# EAGLE schematic Frisk_Schematic (EAGLE 9.7.0)
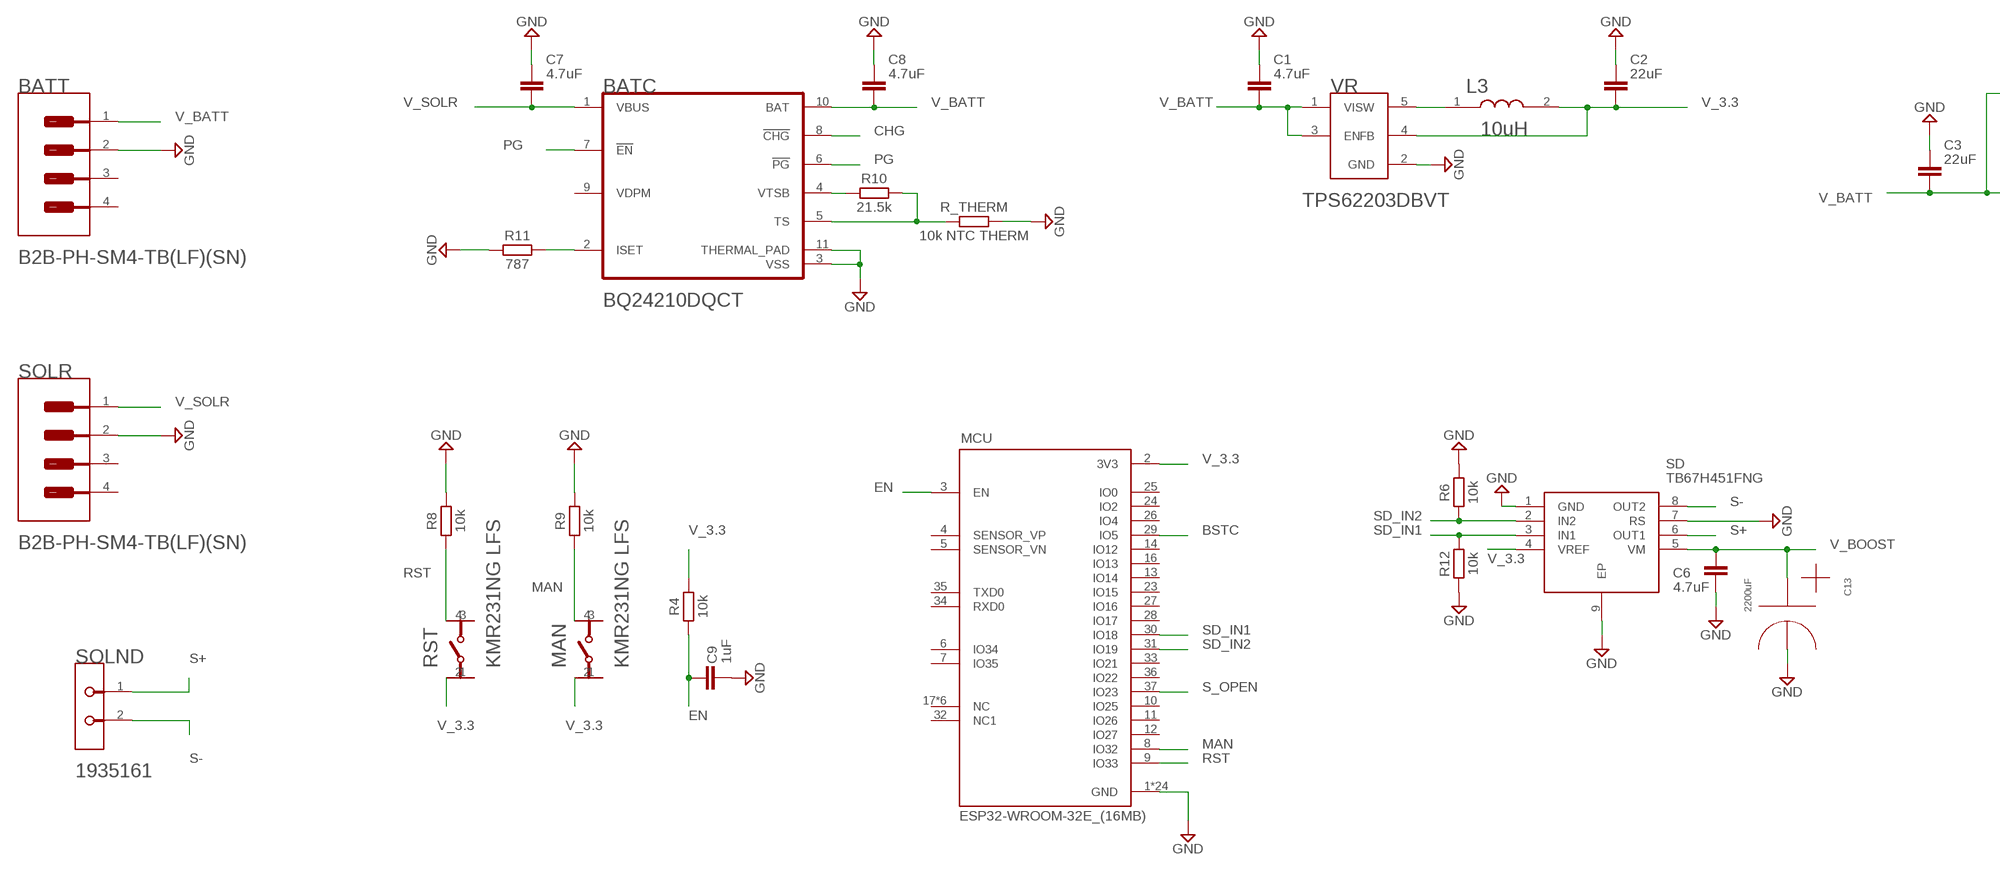
[diagram p0: schematic, sheet 1, part 1 of 2]
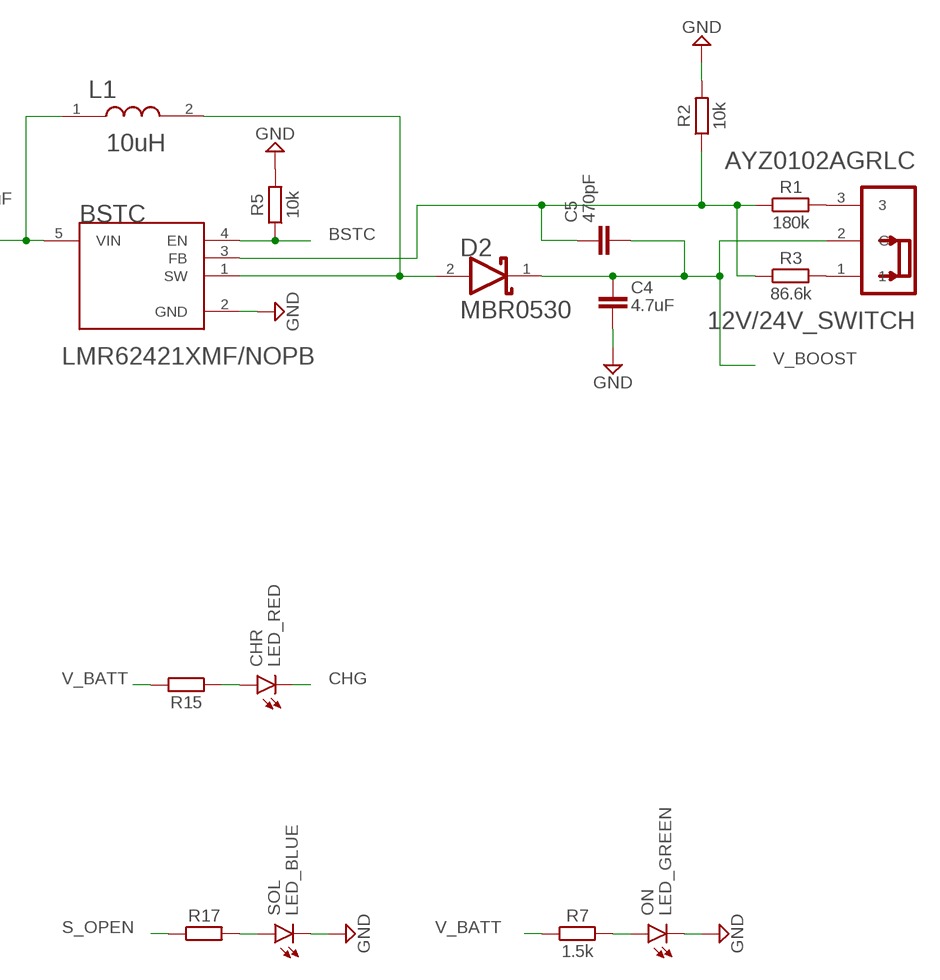
[diagram p1: schematic, sheet 1, part 2 of 2]

## Parts
12V/24V_SWITCH  C&K_AYZ0102AGRLCC&K_AYZ0102AGRLC_0_0  [C&K_AYZ0102AGRLC_0]
BATC  TEXAS_INSTRUMENTS_BQ24210DQCTTEXAS_INSTRUMENTS_BQ24210DQCT_0_2  [TEXAS_INSTRUMENTS_BQ24210DQCT_2]
BATT  JST_B2B-PH-SM4-TB_LF_SNJST_B2B-PH-SM4-TB_LF_SN_0_0  [JST_B2B-PH-SM4-TB_LF_SN_0]
BSTC  TEXAS_INSTRUMENTS_LMR62421XMF-NOPBTEXAS_INSTRUMENTS_LMR62421XMF-NOPB_0_0  [TEXAS_INSTRUMENTS_LMR62421XMF-NOPB_0]
C1  4.7uF  C_CHIP-0603(1608-METRIC)  [CAPC1608X85]
C2  22uF  C_CHIP-1210(3225-METRIC)  [CAPC3225X135]
C3  22uF  C_CHIP-1210(3225-METRIC)  [CAPC3225X135]
C4  4.7uF  C_CHIP-0603(1608-METRIC)  [CAPC1608X85]
C5  470pF  C_CHIP-0603(1608-METRIC)  [CAPC1608X85]
C6  4.7uF  C_CHIP-0603(1608-METRIC)  [CAPC1608X85]
C7  4.7uF  C_CHIP-0603(1608-METRIC)  [CAPC1608X85]
C8  4.7uF  C_CHIP-0603(1608-METRIC)  [CAPC1608X85]
C9  1uF  C_CHIP-0603(1608-METRIC)  [CAPC1608X85]
C13  UVZ1E222  [CAPPRD500W60D1250H2700]
CHR  LED_RED  CHIP-ROUND-R_0603  [LEDC1608X65N_RND-R]
D2  ON_SEMI_MBR0530ON_SEMI_MBR0530_0_2  [ON_SEMI_MBR0530_2]
L1  VISHAY_IHLP2525CZER100M01VISHAY_IHLP2525CZER100M01_0_0  [VISHAY_IHLP2525CZER100M01_0]
L3  VISHAY_IHLP2525CZER100M01VISHAY_IHLP2525CZER100M01_0_0  [VISHAY_IHLP2525CZER100M01_0]
MAN  C&K_COMPONENTS_KMR231NG_LFSC&K_COMPONENTS_KMR231NG_LFS_0_0  [C&K_COMPONENTS_KMR231NG_LFS_0]
MCU  ESP32-WROOM-32E_(16MB)  [MODULE_ESP32-WROOM-32E_(16MB)]
ON  LED_GREEN  CHIP-ROUND-R_0603  [LEDC1608X65N_RND-R]
R1  180k  R_CHIP-0603(1608-METRIC)  [RESC1608X60]
R2  10k  R_CHIP-0603(1608-METRIC)  [RESC1608X60]
R3  86.6k  R_CHIP-0603(1608-METRIC)  [RESC1608X60]
R4  10k  R_CHIP-0603(1608-METRIC)  [RESC1608X60]
R5  10k  R_CHIP-0603(1608-METRIC)  [RESC1608X60]
R6  10k  R_CHIP-0603(1608-METRIC)  [RESC1608X60]
R7  1.5k  R_CHIP-0603(1608-METRIC)  [RESC1608X60]
R8  10k  R_CHIP-0603(1608-METRIC)  [RESC1608X60]
R9  10k  R_CHIP-0603(1608-METRIC)  [RESC1608X60]
R10  21.5k  R_CHIP-0603(1608-METRIC)  [RESC1608X60]
R11  787  R_CHIP-0603(1608-METRIC)  [RESC1608X60]
R12  10k  R_CHIP-0603(1608-METRIC)  [RESC1608X60]
R15  1.5k  R_CHIP-0603(1608-METRIC)  [RESC1608X60]
R17  1.5k  R_CHIP-0603(1608-METRIC)  [RESC1608X60]
R_THERM  10k NTC THERM  R_CHIP-0603(1608-METRIC)  [RESC1608X60]
RST  C&K_COMPONENTS_KMR231NG_LFSC&K_COMPONENTS_KMR231NG_LFS_0_0  [C&K_COMPONENTS_KMR231NG_LFS_0]
SD  TB67H451FNG  [SOIC127P600X170-9N]
SOL  LED_BLUE  CHIP-ROUND-R_0603  [LEDC1608X65N_RND-R]
SOLND  PHOENIX_CONTACT_1935161PHOENIX_CONTACT_1935161_0_0  [PHOENIX_CONTACT_1935161_0]
SOLR  JST_B2B-PH-SM4-TB_LF_SNJST_B2B-PH-SM4-TB_LF_SN_0_0  [JST_B2B-PH-SM4-TB_LF_SN_0]
VR  TEXAS_INSTRUMENTS_TPS62203DBVTTEXAS_INSTRUMENTS_TPS62203DBVT_0_0  [TEXAS_INSTRUMENTS_TPS62203DBVT_0]

## Nets
BSTC: BSTC.4(EN) MCU.29(IO5) R5.1
CHG: BATC.8(!CHG!) CHR.C
EN [V_LOW]: C9.1 MCU.3(EN) R4.1
GND [GND]: BATC.3(VSS) BATC.11(THERMAL_PAD) BATT.2 BSTC.2(GND) C1.1 C2.1 C3.1 C4.2 C6.2 C7.1 C8.1 C9.2 C13.N MCU.1(GND) MCU.15(GND) MCU.38(GND) MCU.39_1(GND) MCU.39_2(GND) MCU.39_3(GND) MCU.39_4(GND) MCU.39_5(GND) MCU.39_6(GND) MCU.39_7(GND) MCU.39_8(GND) MCU.39_9(GND) MCU.39_10(GND) MCU.39_11(GND) MCU.39_12(GND) MCU.39_13(GND) MCU.39_14(GND) MCU.39_15(GND) MCU.39_16(GND) MCU.39_17(GND) MCU.39_18(GND) MCU.39_19(GND) MCU.39_20(GND) MCU.39_21(GND) ON.C R2.2 R5.2 R6.2 R8.2 R9.2 R11.1 R12.1 R_THERM.2 SD.1(GND) SD.7(RS) SD.9(EP) SOL.C SOLR.2 VR.2(GND)
MAN: MAN.4 MCU.8(IO32) R9.1
N$1: CHR.A R15.1
N$2: L3.1 VR.5(SW)
N$3: ON.A R7.2
N$4: BATC.5(TS) R10.2 R_THERM.1
N$5: BSTC.1(SW) D2.2(ANODE) L1.2
N$7: BSTC.3(FB) C5.1 R1.1 R2.1 R3.1
N$8: 12V/24V_SWITCH.3 R1.2
N$9: 12V/24V_SWITCH.1 R3.2
N$10: BATC.4(VTSB) R10.1
N$11: BATC.2(ISET) R11.2
N$18: R17.2 SOL.A
PG: BATC.6(!PG!) BATC.7(!EN!)
RST: MCU.9(IO33) R8.1 RST.4
S+ [V_HIGH]: SD.6(OUT1) SOLND.1
S- [V_HIGH]: SD.8(OUT2) SOLND.2
S_OPEN: MCU.37(IO23) R17.1
SD_IN1: MCU.30(IO18) R12.2 SD.3(IN1)
SD_IN2: MCU.31(IO19) R6.1 SD.2(IN2)
V_3.3 [V_LOW]: C2.2 L3.2 MAN.2 MCU.2(3V3) R4.2 RST.2 SD.4(VREF) VR.4(FB)
V_BATT [V_LOW]: BATC.10(BAT) BATT.1 BSTC.5(VIN) C1.2 C3.2 C8.2 L1.1 R7.1 R15.2 VR.1(VI) VR.3(EN)
V_BOOST [V_HIGH]: 12V/24V_SWITCH.2(C) C4.1 C5.2 C6.1 C13.P D2.1(CATHODE) SD.5(VM)
V_SOLR [V_LOW]: BATC.1(VBUS) C7.2 SOLR.1
Unconnected: BATT.3(MNT_1) BATT.4(MNT_2) MAN.1 MAN.3 MCU.4(SENSOR_VP) MCU.5(SENSOR_VN) MCU.6(IO34) MCU.7(IO35) MCU.10(IO25) MCU.11(IO26) MCU.12(IO27) MCU.13(IO14) MCU.14(IO12) MCU.16(IO13) MCU.17(NC) MCU.18(NC) MCU.19(NC) MCU.20(NC) MCU.21(NC) MCU.22(NC) MCU.23(IO15) MCU.24(IO2) MCU.25(IO0) MCU.26(IO4) MCU.27(IO16) MCU.28(IO17) MCU.32(NC1) MCU.33(IO21) MCU.34(RXD0) MCU.35(TXD0) MCU.36(IO22) RST.1 RST.3 SOLR.3(MNT_1) SOLR.4(MNT_2)

## Power pins joined to a net without a drawn wire
VDPM: BATC.9(VDPM)

## Library data of the parts
12V/24V_SWITCH = C&K - AYZ0102AGRLC:C&K_AYZ0102AGRLC: Miniature Slide Switches; AUTOMOTIVE: No; CENTROID_NOT_SPECIFIED: No; CONTACT_CURRENT_RATING: 100mA; CONTACT_RESISTANCE: 80mΩ; DATASHEET: https://www.ckswitches.com/media/1431/ayz.pdf; DEVICE_CLASS_L1: Electromechanical; DEVICE_CLASS_L2: Switches; DEVICE_CLASS_L3: Slide Switches; DIGIKEY_DESCRIPTION: SWITCH SLIDE SPDT 100MA 12V; DIGIKEY_PART_NUMBER: 401-2012-1-ND; ELECTROMECHANICAL_LIFE: 10000Cycles; FOOTPRINT_VARIANT_NAME_0: Recommended_Land_Pattern; HEIGHT: 1.5mm; LEAD_FREE: Yes; MF: C&K; MFG_PACKAGE_IDENT: 0; MFG_PACKAGE_IDENT_DATE: 0; MFG_PACKAGE_IDENT_REV: 0; MOUNT: Surface Mount; MOUSER_DESCRIPTION: Slide Switches SPDT SMT 1.2A SUBMIN; MOUSER_PART_NUMBER: 611-AYZ0102AGRLC; MPN: AYZ0102AGRLC; PACKAGE: SMT_7MM2_5MM3; PREFIX: SW; ROHS: Yes; TEMPERATURE_RANGE_HIGH: +60°C; TEMPERATURE_RANGE_LOW: -10°C; THROW_CONFIGURATION: SPDT; VERIFICATION_VERSION: 0.0.0.3; VOLTAGE_RATING_DC: 12V
BATC = Texas Instruments - BQ24210DQCT:TEXAS_INSTRUMENTS_BQ24210DQCT: 800mA, single-input, single cell Li-ion Solar battery charger, 10-WSON (3x2); AUTOMOTIVE: No; CENTROID_NOT_SPECIFIED: No; DATASHEET: https://www.ti.com/lit/ds/symlink/bq24210.pdf?ts=1599751812951&ref_url=https%253A%252F%252Fwww.ti.com%252Fstore%252Fti%252Fen%252Fp%252Fproduct%252F%253Fp%253DBQ24210DQCT%2526keyMatch%253DBQ24210DQCT%2526tisearch%253DSearch-EN-everything%2526usecase%253DOPN; DEVICE_CLASS_L1: Integrated Circuits (ICs); DEVICE_CLASS_L2: Power Management ICs; DEVICE_CLASS_L3: Battery Management; DIGIKEY_DESCRIPTION: IC BATT CHARGER LI-ION 10WSON; DIGIKEY_PART_NUMBER: 296-28738-1-ND; FOOTPRINT_PARAMETERS_1: {"fp_type":"DFN","params":{"N":{"nom":10,"long name":"Number of leads","min":null,"max":null,"short name":"N","type":"count"},"A":{"nom":750000,"long name":"Height","min":700000,"max":800000,"short name":"A","type":"measurement"},"A1":{"nom":25000,"long name":"Package clearance","min":0,"max":50000,"short name":"A1","type":"measurement"},"A2":{"nom":725000,"long name":"Package height","min":650000,"max":800000,"short name":"A2","type":"measurement"},"D":{"nom":3000000,"long name":"Package length","min":2900000,"max":3100000,"short name":"D","type":"measurement"},"E":{"nom":2000000,"long name":"Package width","min":1900000,"max":2100000,"short name":"E","type":"measurement"},"B":{"nom":250000,"long name":"Lead width","min":200000,"max":300000,"short name":"B","type":"measurement"},"C":{"nom":200000,"long name":"Lead thickness","min":null,"max":null,"short name":"C","type":"measurement"},"L":{"nom":300000,"long name":"Lead foot length","min":250000,"max":350000,"short name":"L","type":"measurement"},"e":{"nom":500000,"long name":"Lead pitch","min":null,"max":null,"short name":"e","type":"measurement"},"HT":{"default":"Yes","long name":"Thermal pad","type":"multichoiceparent","short name":"HT","children":["D2","E2","PC"]},"offset x":{"nom":0,"long name":"X Center offset","min":null,"max":null,"short name":"offset x","type":"measurement"},"offset y":{"nom":0,"long name":"Y Center offset","min":null,"max":null,"short name":"offset y","type":"measurement"},"LS":{"default":"Rounded rectangle","long name":"Land shape","type":"multichoice","short name":"LS"},"LS1":{"default":"Rectangle","long name":"Land shape (Pin 1)","type":"multichoice","short name":"LS1"},"solder toe":{"nom":400000,"long name":"Solder fillet (toe)","min":null,"max":null,"short name":"solder toe","type":"fixedmeasurement"},"solder heel":{"nom":0,"long name":"Solder fillet (heel)","min":null,"max":null,"short name":"solder heel","type":"fixedmeasurement"},"solder side":{"nom":-40000,"long name":"Solder fillet (side)","min":null,"max":null,"short name":"solder side","type":"fixedmeasurement"},"courtyard":{"nom":500000,"long name":"Courtyard","min":null,"max":null,"short name":"courtyard","type":"fixedmeasurement"},"SF":{"default":"A","long name":"Packing level","type":"multichoiceparent","short name":"SF","help":"http://support.upverter.com/customer/portal/articles/978783-what-is-a-footprint-packing-level","children":["solder toe","solder heel","solder side","courtyard"]},"D2":{"nom":2400000,"long name":"Thermal pad length","min":2300000,"max":2500000,"short name":"D2","type":"measurement"},"E2":{"nom":840000,"long name":"Thermal pad width","min":740000,"max":940000,"short name":"E2","type":"measurement"},"PC":{"long name":"Paste coverage (%)","type":"percentage","short name":"PC","value":40}}}; FOOTPRINT_PARAMETERS_2: {"fp_type":"DFN","params":{"N":{"nom":10,"long name":"Number of leads","min":null,"max":null,"short name":"N","type":"count"},"A":{"nom":750000,"long name":"Height","min":700000,"max":800000,"short name":"A","type":"measurement"},"A1":{"nom":25000,"long name":"Package clearance","min":0,"max":50000,"short name":"A1","type":"measurement"},"A2":{"nom":725000,"long name":"Package height","min":650000,"max":800000,"short name":"A2","type":"measurement"},"D":{"nom":3000000,"long name":"Package length","min":2900000,"max":3100000,"short name":"D","type":"measurement"},"E":{"nom":2000000,"long name":"Package width","min":1900000,"max":2100000,"short name":"E","type":"measurement"},"B":{"nom":250000,"long name":"Lead width","min":200000,"max":300000,"short name":"B","type":"measurement"},"C":{"nom":200000,"long name":"Lead thickness","min":null,"max":null,"short name":"C","type":"measurement"},"L":{"nom":300000,"long name":"Lead foot length","min":250000,"max":350000,"short name":"L","type":"measurement"},"e":{"nom":500000,"long name":"Lead pitch","min":null,"max":null,"short name":"e","type":"measurement"},"D2":{"nom":2400000,"long name":"Thermal pad length","min":2300000,"max":2500000,"short name":"D2","type":"measurement"},"E2":{"nom":840000,"long name":"Thermal pad width","min":740000,"max":940000,"short name":"E2","type":"measurement"},"PC":{"long name":"Paste coverage (%)","type":"percentage","short name":"PC","value":40},"HT":{"default":"Yes","long name":"Thermal pad","type":"multichoiceparent","short name":"HT","children":["D2","E2","PC"]},"offset x":{"nom":0,"long name":"X Center offset","min":null,"max":null,"short name":"offset x","type":"measurement"},"offset y":{"nom":0,"long name":"Y Center offset","min":null,"max":null,"short name":"offset y","type":"measurement"},"LS":{"default":"Rounded rectangle","long name":"Land shape","type":"multichoice","short name":"LS"},"LS1":{"default":"Rectangle","long name":"Land shape (Pin 1)","type":"multichoice","short name":"LS1"},"solder toe":{"nom":300000,"long name":"Solder fillet (toe)","min":null,"max":null,"short name":"solder toe","type":"fixedmeasurement"},"solder heel":{"nom":0,"long name":"Solder fillet (heel)","min":null,"max":null,"short name":"solder heel","type":"fixedmeasurement"},"solder side":{"nom":-40000,"long name":"Solder fillet (side)","min":null,"max":null,"short name":"solder side","type":"fixedmeasurement"},"courtyard":{"nom":250000,"long name":"Courtyard","min":null,"max":null,"short name":"courtyard","type":"fixedmeasurement"},"SF":{"default":"B","long name":"Packing level","type":"multichoiceparent","short name":"SF","help":"http://support.upverter.com/customer/portal/articles/978783-what-is-a-footprint-packing-level","children":["solder toe","solder heel","solder side","courtyard"]}}}; FOOTPRINT_PARAMETERS_3: {"fp_type":"DFN","params":{"N":{"nom":10,"long name":"Number of leads","min":null,"max":null,"short name":"N","type":"count"},"A":{"nom":750000,"long name":"Height","min":700000,"max":800000,"short name":"A","type":"measurement"},"A1":{"nom":25000,"long name":"Package clearance","min":0,"max":50000,"short name":"A1","type":"measurement"},"A2":{"nom":725000,"long name":"Package height","min":650000,"max":800000,"short name":"A2","type":"measurement"},"D":{"nom":3000000,"long name":"Package length","min":2900000,"max":3100000,"short name":"D","type":"measurement"},"E":{"nom":2000000,"long name":"Package width","min":1900000,"max":2100000,"short name":"E","type":"measurement"},"B":{"nom":250000,"long name":"Lead width","min":200000,"max":300000,"short name":"B","type":"measurement"},"C":{"nom":200000,"long name":"Lead thickness","min":null,"max":null,"short name":"C","type":"measurement"},"L":{"nom":300000,"long name":"Lead foot length","min":250000,"max":350000,"short name":"L","type":"measurement"},"e":{"nom":500000,"long name":"Lead pitch","min":null,"max":null,"short name":"e","type":"measurement"},"D2":{"nom":2400000,"long name":"Thermal pad length","min":2300000,"max":2500000,"short name":"D2","type":"measurement"},"E2":{"nom":840000,"long name":"Thermal pad width","min":740000,"max":940000,"short name":"E2","type":"measurement"},"PC":{"long name":"Paste coverage (%)","type":"percentage","short name":"PC","value":40},"HT":{"default":"Yes","long name":"Thermal pad","type":"multichoiceparent","short name":"HT","children":["D2","E2","PC"]},"offset x":{"nom":0,"long name":"X Center offset","min":null,"max":null,"short name":"offset x","type":"measurement"},"offset y":{"nom":0,"long name":"Y Center offset","min":null,"max":null,"short name":"offset y","type":"measurement"},"LS":{"default":"Rounded rectangle","long name":"Land shape","type":"multichoice","short name":"LS"},"LS1":{"default":"Rectangle","long name":"Land shape (Pin 1)","type":"multichoice","short name":"LS1"},"solder toe":{"nom":200000,"long name":"Solder fillet (toe)","min":null,"max":null,"short name":"solder toe","type":"fixedmeasurement"},"solder heel":{"nom":0,"long name":"Solder fillet (heel)","min":null,"max":null,"short name":"solder heel","type":"fixedmeasurement"},"solder side":{"nom":-40000,"long name":"Solder fillet (side)","min":null,"max":null,"short name":"solder side","type":"fixedmeasurement"},"courtyard":{"nom":100000,"long name":"Courtyard","min":null,"max":null,"short name":"courtyard","type":"fixedmeasurement"},"SF":{"default":"C","long name":"Packing level","type":"multichoiceparent","short name":"SF","help":"http://support.upverter.com/customer/portal/articles/978783-what-is-a-footprint-packing-level","children":["solder toe","solder heel","solder side","courtyard"]}}}; FOOTPRINT_VARIANT_NAME_0: Recommended_Land_Pattern; FOOTPRINT_VARIANT_NAME_1: IPC_A; FOOTPRINT_VARIANT_NAME_2: IPC_B; FOOTPRINT_VARIANT_NAME_3: IPC_C; HEIGHT: 0.8mm; IMPORTED_FROM: vault; IMPORT_TS: 1521175915; LEAD_FREE: Yes; MAX_JUNCTION_TEMP: +125°C; MAX_SUPPLY_VOLTAGE: 18V; MF: Texas Instruments; MFG_PACKAGE_IDENT: DQC0010A; MFG_PACKAGE_IDENT_COMPONENT_ID: 5c282db217c73b58; MFG_PACKAGE_IDENT_DATE: 0; MFG_PACKAGE_IDENT_REV: 0; MIN_SUPPLY_VOLTAGE: 3.5V; MOUSER_DESCRIPTION: 800mA, single-input, single cell Li-ion Solar battery charger 10-WSON -40 to 85; MOUSER_PART_NUMBER: 595-BQ24210DQCT; MPN: BQ24210DQCT; NOMINAL_SUPPLY_CURRENT: 0.8mA; NUMBER_OF_CELLS: 1; OUTPUT_CURRENT: 800mA; PACKAGE: WSON10; PREFIX: U; ROHS: Yes; STANDOFF_HEIGHT: 0mm; TEMPERATURE_RANGE_HIGH: +85°C; TEMPERATURE_RANGE_LOW: -40°C; VAULT_GUID: 3C1E92C9-7C0E-4F0B-8E5B-B3C5C5314291; VERIFICATION_VERSION: 0.0.0.3
BATT SOLR = JST - B2B-PH-SM4-TB(LF)(SN):JST_B2B-PH-SM4-TB_LF_SN: 2.0 mm pitch/Disconnectable Crimp style connectors; CENTROID_NOT_SPECIFIED: No; COLOR: White; CONTACT_MATERIAL: Brass; CONTACT_PLATING: Tin; CURRENT_RATING: 2 A; DATASHEET: https://upverter.com/datasheet/05f4473ffc638d76a3bb68900fd4324175be47ba.pdf; DIGIKEY_DESCRIPTION: CONN 2 Positions Header, Shrouded Connector 0.079" (2.00mm) Surface Mount Tin; DIGIKEY_PART_NUMBER: 455-1734-1-ND; FLAMMABILITY_RATING: UL 94 V-0; GENDER: Female; HOUSING_COLOR: Natural; HOUSING_MATERIAL: Nylon; IMPORTED_FROM: octopart; INSULATION_RESISTANCE: 1 GΩ; LEAD_FREE: yes; MF: JST; MOUNTING_TYPE: surface mount; MPN: B2B-PH-SM4-TB(LF)(SN); NUMBER_OF_CONTACTS: 2; NUMBER_OF_POSITIONS: 2; NUMBER_OF_ROWS: 1; NUM_PINS: 2; PACKAGE: CONN_SMT_7MM95_5MM0; PIN_PITCH: 2 mm; PREFIX: J; ROHS: yes; SIZE_HEIGHT: 6.6 mm; SIZE_LENGTH: 7.95 mm; SIZE_WIDTH: 5 mm; TEMPERATURE_RANGE_HIGH: +85˚C; TEMPERATURE_RANGE_LOW: -25˚C; VOLTAGE_RATING_AC: 100 V
BSTC = LMR62421:TEXAS_INSTRUMENTS_LMR62421XMF-NOPB: Boost, SEPIC Switching Regulator IC Positive Adjustable 2.7V 1 Output 2.1A (Switch) SC-74A, SOT-753; CENTROID_NOT_SPECIFIED: No; DATASHEET: http://www.ti.com/lit/ds/symlink/lmr62421.pdf; DIGIKEY_DESCRIPTION: IC REG BST SEPIC ADJ 2.1A SOT23; DIGIKEY_PART_NUMBER: 296-39047-1-ND; LEAD_FREE: yes; MF: Texas Instruments; MFG_PACKAGE_IDENT: DBV(R-PDSO-G5); MOUSER_PART_NUMBER: 926-LMR62421XMF/NOPB; MPN: LMR62421XMF/NOPB; PACKAGE: SOT-23-5; PREFIX: U; ROHS: yes; TEMPERATURE_RANGE_HIGH: +125°C; TEMPERATURE_RANGE_LOW: -40°C
C1-C9 = Capacitor:C: Capacitor - Generic; CATEGORY: Capacitor
C13 = CAPPRD500W60D1250H2700:UVZ1E222
CHR = LED:CHIP-ROUND-R: LED - Generic; CATEGORY: LED; COLOR: RED; DESCRIPTION: CHIP LED ROUND; SUB-CATEGORY: CHIP; TYPE: ROUND_TOP
D2 = MBR0530:ON_SEMI_MBR0530: Diode Schottky 30V 500mA Surface Mount SOD-123; AUTOMOTIVE: No; CENTROID_NOT_SPECIFIED: No; DATASHEET: http://www.onsemi.com/pub/Collateral/MBR0530T1-D.PDF; DC_BLOCKING_VOLTAGE: 30V; DEVICE_CLASS_L1: Discrete Semiconductors; DEVICE_CLASS_L2: Diodes; DEVICE_CLASS_L3: Schottky Diodes; DIGIKEY_DESCRIPTION: DIODE SCHOTTKY 30V 500MA SOD123; DIGIKEY_PART_NUMBER: MBR0530CT-ND; FOOTPRINT_PARAMETERS_1: {"fp_type":"SOD123","params":{"N":{"long name":"Number of leads","type":"fixed","short name":"N","value":2},"A":{"nom":1170000,"long name":"Height","min":940000,"max":1350000,"short name":"A","type":"measurement"},"A1":{"nom":50000,"long name":"Package clearance","min":0,"max":100000,"short name":"A1","type":"measurement"},"A2":{"nom":1120000,"long name":"Package height","min":840000,"max":1350000,"short name":"A2","type":"measurement"},"D":{"nom":3680000,"long name":"Length /w leads","min":3560000,"max":3860000,"short name":"D","type":"measurement"},"D1":{"nom":2690000,"long name":"Package length","min":2540000,"max":2840000,"short name":"D1","type":"measurement"},"E":{"nom":1600000,"long name":"Package width","min":1400000,"max":1800000,"short name":"E","type":"measurement"},"B":{"nom":610000,"long name":"Lead width","min":510000,"max":710000,"short name":"B","type":"measurement"},"C":{"nom":false,"long name":"Lead thickness","min":false,"max":150000,"short name":"C","type":"measurement"},"L":{"nom":false,"long name":"Lead foot length","min":250000,"max":false,"short name":"L","type":"measurement"},"PHI":{"nom":false,"long name":"Lead angle","min":0,"max":10000000,"short name":"PHI","type":"measurement"},"offset x":{"nom":0,"long name":"X Center offset","min":null,"max":null,"short name":"offset x","type":"measurement"},"offset y":{"nom":0,"long name":"Y Center offset","min":null,"max":null,"short name":"offset y","type":"measurement"},"LS":{"default":"Rounded rectangle","long name":"Land shape","type":"multichoice","short name":"LS"},"LS1":{"default":"Rectangle","long name":"Land shape (Pin 1)","type":"multichoice","short name":"LS1"},"solder toe":{"nom":550000,"long name":"Solder fillet (toe)","min":null,"max":null,"short name":"solder toe","type":"fixedmeasurement"},"solder heel":{"nom":450000,"long name":"Solder fillet (heel)","min":null,"max":null,"short name":"solder heel","type":"fixedmeasurement"},"solder side":{"nom":50000,"long name":"Solder fillet (side)","min":null,"max":null,"short name":"solder side","type":"fixedmeasurement"},"courtyard":{"nom":500000,"long name":"Courtyard","min":null,"max":null,"short name":"courtyard","type":"fixedmeasurement"},"SF":{"default":"A","long name":"Packing level","type":"multichoiceparent","short name":"SF","help":"http://support.upverter.com/customer/portal/articles/978783-what-is-a-footprint-packing-level","children":["solder toe","solder heel","solder side","courtyard"]}}}; FOOTPRINT_PARAMETERS_2: {"fp_type":"SOD123","params":{"N":{"long name":"Number of leads","type":"fixed","short name":"N","value":2},"A":{"nom":1170000,"long name":"Height","min":940000,"max":1350000,"short name":"A","type":"measurement"},"A1":{"nom":50000,"long name":"Package clearance","min":0,"max":100000,"short name":"A1","type":"measurement"},"A2":{"nom":1120000,"long name":"Package height","min":840000,"max":1350000,"short name":"A2","type":"measurement"},"D":{"nom":3680000,"long name":"Length /w leads","min":3560000,"max":3860000,"short name":"D","type":"measurement"},"D1":{"nom":2690000,"long name":"Package length","min":2540000,"max":2840000,"short name":"D1","type":"measurement"},"E":{"nom":1600000,"long name":"Package width","min":1400000,"max":1800000,"short name":"E","type":"measurement"},"B":{"nom":610000,"long name":"Lead width","min":510000,"max":710000,"short name":"B","type":"measurement"},"C":{"nom":false,"long name":"Lead thickness","min":false,"max":150000,"short name":"C","type":"measurement"},"L":{"nom":false,"long name":"Lead foot length","min":250000,"max":false,"short name":"L","type":"measurement"},"PHI":{"nom":false,"long name":"Lead angle","min":0,"max":10000000,"short name":"PHI","type":"measurement"},"offset x":{"nom":0,"long name":"X Center offset","min":null,"max":null,"short name":"offset x","type":"measurement"},"offset y":{"nom":0,"long name":"Y Center offset","min":null,"max":null,"short name":"offset y","type":"measurement"},"LS":{"default":"Rounded rectangle","long name":"Land shape","type":"multichoice","short name":"LS"},"LS1":{"default":"Rectangle","long name":"Land shape (Pin 1)","type":"multichoice","short name":"LS1"},"solder toe":{"nom":350000,"long name":"Solder fillet (toe)","min":null,"max":null,"short name":"solder toe","type":"fixedmeasurement"},"solder heel":{"nom":350000,"long name":"Solder fillet (heel)","min":null,"max":null,"short name":"solder heel","type":"fixedmeasurement"},"solder side":{"nom":30000,"long name":"Solder fillet (side)","min":null,"max":null,"short name":"solder side","type":"fixedmeasurement"},"courtyard":{"nom":250000,"long name":"Courtyard","min":null,"max":null,"short name":"courtyard","type":"fixedmeasurement"},"SF":{"default":"B","long name":"Packing level","type":"multichoiceparent","short name":"SF","help":"http://support.upverter.com/customer/portal/articles/978783-what-is-a-footprint-packing-level","children":["solder toe","solder heel","solder side","courtyard"]}}}; FOOTPRINT_PARAMETERS_3: {"fp_type":"SOD123","params":{"N":{"long name":"Number of leads","type":"fixed","short name":"N","value":2},"A":{"nom":1170000,"long name":"Height","min":940000,"max":1350000,"short name":"A","type":"measurement"},"A1":{"nom":50000,"long name":"Package clearance","min":0,"max":100000,"short name":"A1","type":"measurement"},"A2":{"nom":1120000,"long name":"Package height","min":840000,"max":1350000,"short name":"A2","type":"measurement"},"D":{"nom":3680000,"long name":"Length /w leads","min":3560000,"max":3860000,"short name":"D","type":"measurement"},"D1":{"nom":2690000,"long name":"Package length","min":2540000,"max":2840000,"short name":"D1","type":"measurement"},"E":{"nom":1600000,"long name":"Package width","min":1400000,"max":1800000,"short name":"E","type":"measurement"},"B":{"nom":610000,"long name":"Lead width","min":510000,"max":710000,"short name":"B","type":"measurement"},"C":{"nom":false,"long name":"Lead thickness","min":false,"max":150000,"short name":"C","type":"measurement"},"L":{"nom":false,"long name":"Lead foot length","min":250000,"max":false,"short name":"L","type":"measurement"},"PHI":{"nom":false,"long name":"Lead angle","min":0,"max":10000000,"short name":"PHI","type":"measurement"},"offset x":{"nom":0,"long name":"X Center offset","min":null,"max":null,"short name":"offset x","type":"measurement"},"offset y":{"nom":0,"long name":"Y Center offset","min":null,"max":null,"short name":"offset y","type":"measurement"},"LS":{"default":"Rounded rectangle","long name":"Land shape","type":"multichoice","short name":"LS"},"LS1":{"default":"Rectangle","long name":"Land shape (Pin 1)","type":"multichoice","short name":"LS1"},"solder toe":{"nom":150000,"long name":"Solder fillet (toe)","min":null,"max":null,"short name":"solder toe","type":"fixedmeasurement"},"solder heel":{"nom":250000,"long name":"Solder fillet (heel)","min":null,"max":null,"short name":"solder heel","type":"fixedmeasurement"},"solder side":{"nom":10000,"long name":"Solder fillet (side)","min":null,"max":null,"short name":"solder side","type":"fixedmeasurement"},"courtyard":{"nom":100000,"long name":"Courtyard","min":null,"max":null,"short name":"courtyard","type":"fixedmeasurement"},"SF":{"default":"C","long name":"Packing level","type":"multichoiceparent","short name":"SF","help":"http://support.upverter.com/customer/portal/articles/978783-what-is-a-footprint-packing-level","children":["solder toe","solder heel","solder side","courtyard"]}}}; FOOTPRINT_URL: http://www.onsemi.com/pub/Collateral/425-04.PDF; FOOTPRINT_VARIANT_NAME_0: Recommended_Land_Pattern; FOOTPRINT_VARIANT_NAME_1: IPC_A; FOOTPRINT_VARIANT_NAME_2: IPC_B; FOOTPRINT_VARIANT_NAME_3: IPC_C; FORWARD_CURRENT: 500mA; HEIGHT: 1.35mm; IPC_LAND_PATTERN_NAME: SOD368160X117-2; LEAD_FREE: Yes; MAX_JUNCTION_TEMP: +125°C; MAX_REPETITIVE_REVERSE_VOLTAGE: 30V; MAX_SURGE_FORWARD_CURRENT: 5.5A; MF: ON Semi; MFG_PACKAGE_IDENT: 425-04; MFG_PACKAGE_IDENT_COMPONENT_ID: a4c7e1e246482822; MFG_PACKAGE_IDENT_DATE: 10/2009; MFG_PACKAGE_IDENT_REV: G; MOUSER_PART_NUMBER: 512-MBR0530; MPN: MBR0530; PACKAGE: SOD-123; PEAK_REVERSE_CURRENT: 130uA; PREFIX: D; ROHS: Yes; STANDOFF_HEIGHT: 0mm; TEMPERATURE_RANGE_HIGH: +125°C; TEMPERATURE_RANGE_LOW: -65°C; VERIFICATION_VERSION: 0.0.0.3
L1 L3 = Vishay - IHLP2525CZER100M01:VISHAY_IHLP2525CZER100M01: Commercial Inductors, High Saturation Series 10uH 3A 105mΩ 20%; AUTOMOTIVE: No; CENTROID_NOT_SPECIFIED: No; COMPOSITION: Wirewound; CORE_MATERIAL: SMC; DATASHEET: http://www.vishay.com/doc?34104; DEVICE_CLASS_L1: Passive Components; DEVICE_CLASS_L2: Inductors; DEVICE_CLASS_L3: Fixed Inductors; FOOTPRINT_VARIANT_NAME_0: Recommended_Land_Pattern; HEIGHT: 3mm; INDUCTANCE: 10uH; LEAD_FREE: Yes; MF: Vishay; MFG_PACKAGE_IDENT: IHLP-2525CZ-FP_2.413x3.429-3D_3.0; MFG_PACKAGE_IDENT_COMPONENT_ID: 3ae1c095ea610fd9; MFG_PACKAGE_IDENT_DATE: 0; MFG_PACKAGE_IDENT_REV: 0; MPN: IHLP2525CZER100M01; PACKAGE: SMT_INDUCTOR_6MM47_6MM47; PREFIX: L; RMS_CURRENT: 3A; ROHS: Yes; SATURATION_CURRENT: 7A; SELF_RESONANT_FREQUENCY: 16MHz; SERIES_RESISTANCE: 105mΩ; SHIELDING: true; TEMPERATURE_RANGE_HIGH: +125°C; TEMPERATURE_RANGE_LOW: -55°C; TEST_FREQUENCY: 100kHz; TOLERANCE: 20%; VERIFICATION_VERSION: 0.0.0.3
MAN RST = C&K Components - KMR231NG LFS:C&K_COMPONENTS_KMR231NG_LFS: Tactile Switch SPST-NO Top Actuated Surface Mount; AUTOMOTIVE: No; CENTROID_NOT_SPECIFIED: No; CONTACT_CURRENT_RATING: 50mA; CONTACT_RESISTANCE: 100mΩ; DATASHEET: https://www.ckswitches.com/media/1479/kmr2.pdf; DEVICE_CLASS_L1: Electromechanical; DEVICE_CLASS_L2: Switches; DEVICE_CLASS_L3: Tactile Switches; DIGIKEY_DESCRIPTION: SWITCH TACTILE SPST-NO 0.05A 32V; DIGIKEY_PART_NUMBER: CKN10246CT-ND; ELECTROMECHANICAL_LIFE: 150000Cycles; FOOTPRINT_VARIANT_NAME_0: Recommended_Land_Pattern; HEIGHT: 1.9mm; LEAD_FREE: Yes; MF: C&K Components; MFG_PACKAGE_IDENT: 0; MFG_PACKAGE_IDENT_DATE: 0; MFG_PACKAGE_IDENT_REV: 0; MOUNT: Surface Mount; MOUSER_DESCRIPTION: Tactile Switches Tact; MOUSER_PART_NUMBER: 611-KMR231NGLFS; MPN: KMR231NG LFS; OPERATING_FORCE: 3N; PACKAGE: SMD4; PREFIX: SW; ROHS: Yes; TEMPERATURE_RANGE_HIGH: +85°C; TEMPERATURE_RANGE_LOW: -40°C; THROW_CONFIGURATION: SPST-NO; VERIFICATION_VERSION: 0.0.0.3; VOLTAGE_RATING_DC: 32V
MCU = ESP32-WROOM-32E__16MB_:ESP32-WROOM-32E_(16MB): Bluetooth, WiFi 802.11b/g/n, Bluetooth v4.2 +EDR, Class 1, 2 and 3 Transceiver Module 2.4GHz ~ 2.5GHz Integrated, Trace Surface Mount; MANUFACTURER: Espressif Systems; MAXIMUM_PACKAGE_HEIGHT: 3.25mm; PARTREV: 1.1; STANDARD: Manufacturer Recommendations
ON SOL = LED:CHIP-ROUND-R: LED - Generic; CATEGORY: LED; COLOR: RED; DESCRIPTION: CHIP LED ROUND; SUB-CATEGORY: CHIP; TYPE: ROUND_TOP; VALUE: LED_RED
R1-R12 R15 R17 R_THERM = Resistor:R: Resistor Fixed - Generic; CATEGORY: Resistor; SUB-CATEGORY: Fixed
SD = TB67H451FNG:TB67H451FNG: TOSHIBA BiCD Process Integrated Circuit Silicon Monolithic Source: Datasheet <https://toshiba.semicon-storage.com/info/docget.jsp?did=68598&prodName=TB67H451FNG>; DESCRIPTION: TOSHIBA BiCD Process Integrated Circuit Silicon Monolithic; HEIGHT: 1.7mm; MANUFACTURER_NAME: Toshiba; MANUFACTURER_PART_NUMBER: TB67H451FNG
SOLND = Phoenix Contact - 1935161:PHOENIX_CONTACT_1935161: PCB terminal block - PT 1,5/ 2-5,0-H - 1935161; CENTROID_NOT_SPECIFIED: No; DATASHEET: https://media.digikey.com/pdf/Data%20Sheets/Phoenix%20Contact%20PDFs/1935161.pdf; DIGIKEY_DESCRIPTION: CONN TERM BLOCK PCB 2POS 5.0MM GREEN; DIGIKEY_PART_NUMBER: 277-1667-ND; IS_FEMALE: yes; LEAD_FREE: yes; MF: Phoenix Contact; MOUSER_PART_NUMBER: 651-1935161; MPN: 1935161; PACKAGE: TH_TERM_BLOCK_9MM0_10MM0; PREFIX: J; ROHS: yes
VR = Texas Instruments - TPS62203DBVT:TEXAS_INSTRUMENTS_TPS62203DBVT: Buck Switching Regulator IC Positive Fixed 3.3V 1 Output 300mA SC-74A, SOT-753; CENTROID_NOT_SPECIFIED: No; DATASHEET: http://www.ti.com/lit/ds/symlink/tps62200.pdf; DIGIKEY_DESCRIPTION: IC REG BUCK 3.3V 0.3A SYNC SOT23; DIGIKEY_PART_NUMBER: 296-12719-1-ND; LEAD_FREE: yes; MF: Texas Instruments; MFG_PACKAGE_IDENT: DBV0005A; MOUSER_PART_NUMBER: 595-TPS62203DBVT; MPN: TPS62203DBVT; PACKAGE: SOT-23-5; PREFIX: U; ROHS: yes; TEMPERATURE_RANGE_HIGH: +85°C; TEMPERATURE_RANGE_LOW: -40°C

## Net classes
0 default: width 0.127 mm
1 GND: width 0.203 mm
2 V_LOW: width 0.203 mm
5 V_HIGH: width 0.457 mm